# EAGLE design LC_LightCanvas_Rev_2 (EAGLE 7.6.0)
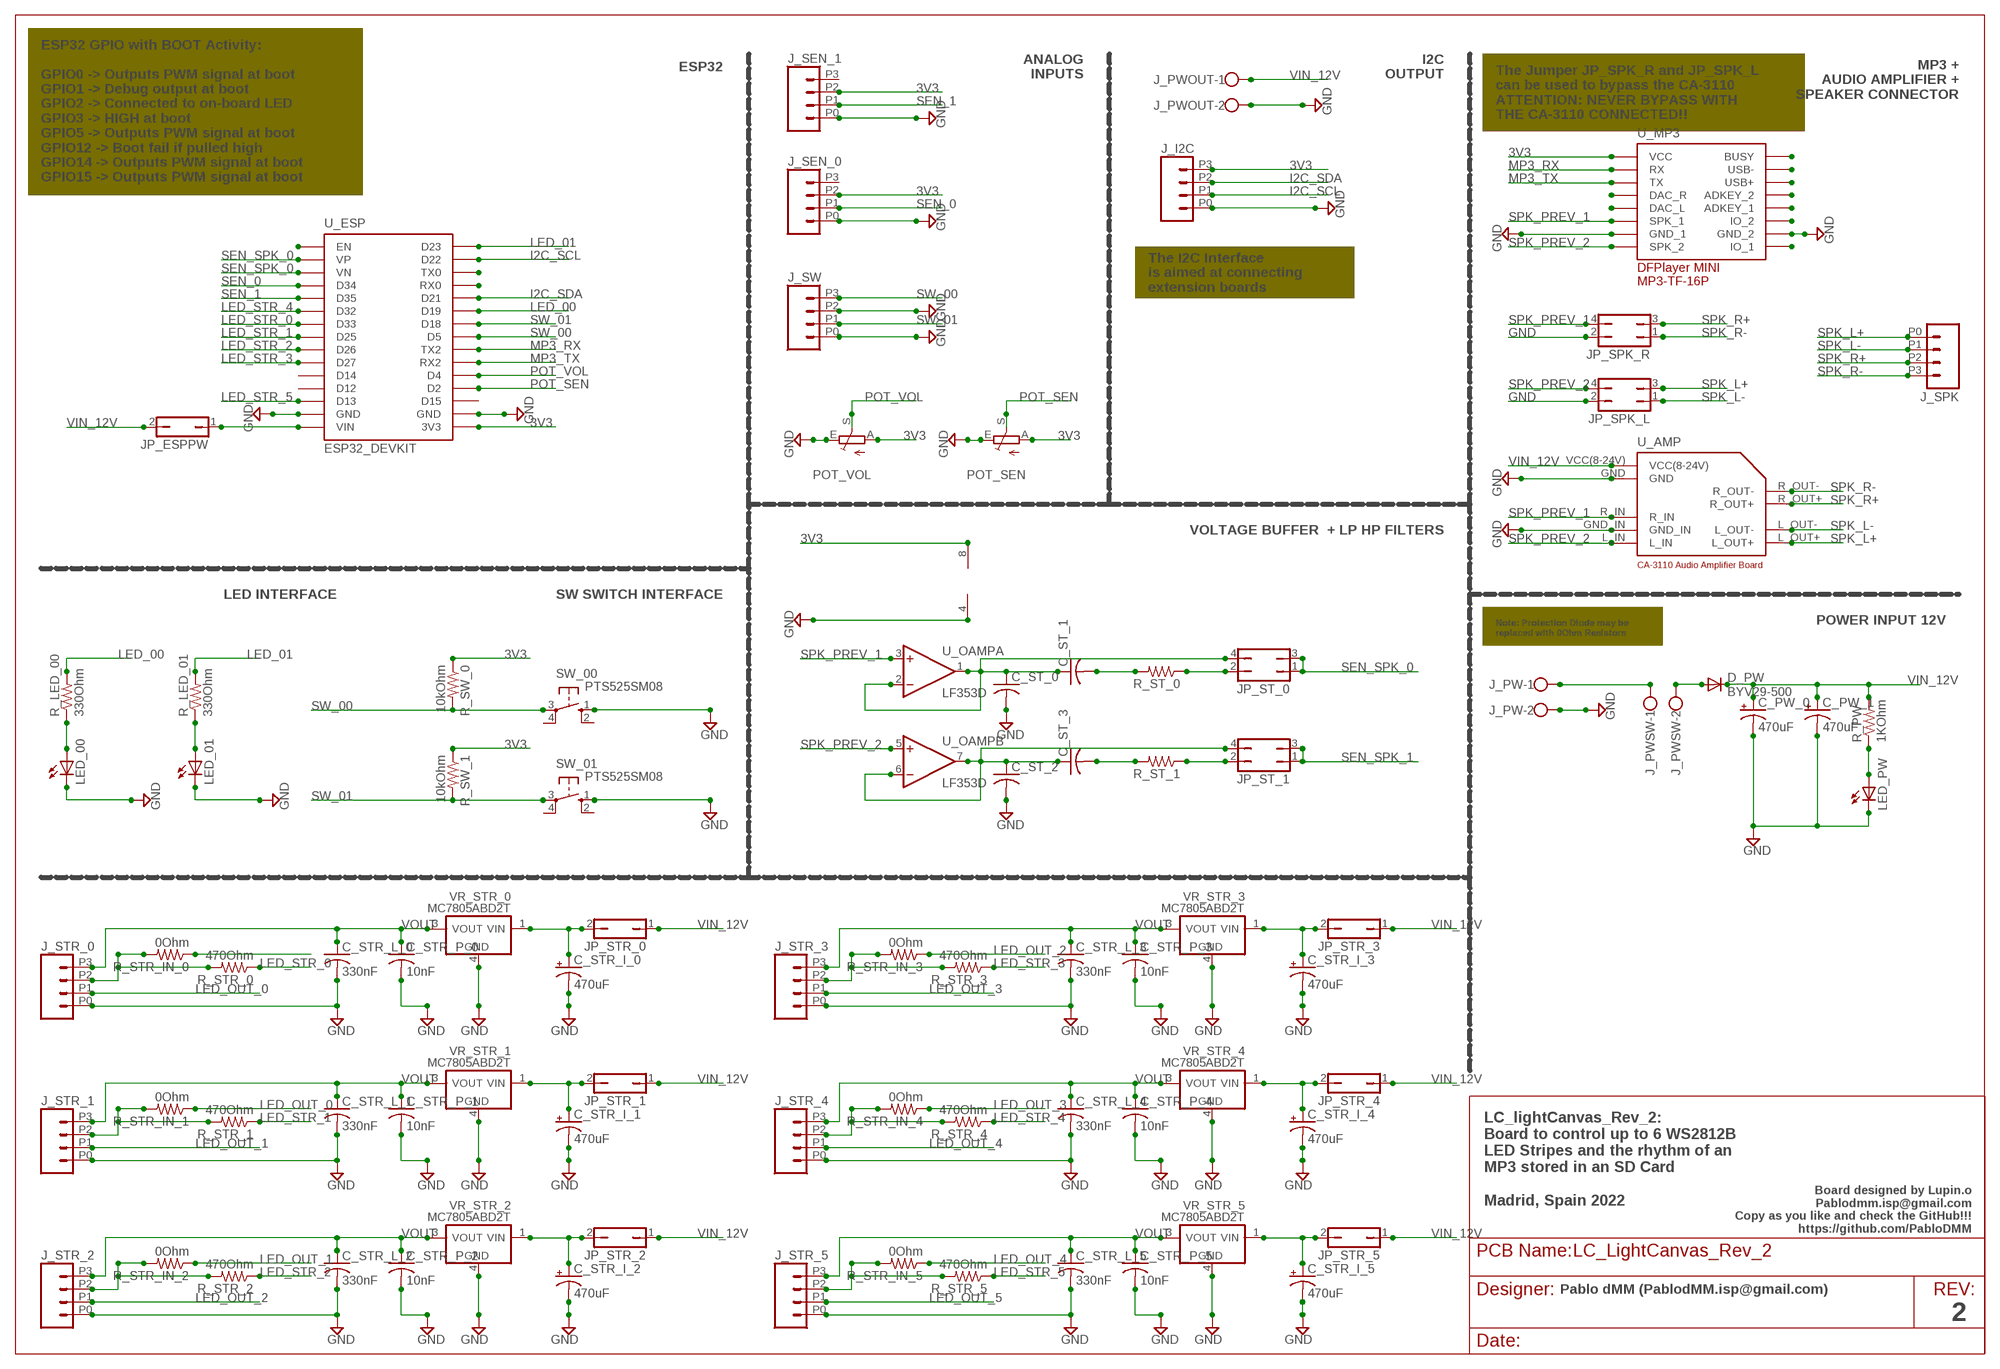
[diagram p0: schematic, sheet 1]

## Parts
C_PW_0  470uF  CPOL-USTT5D10  [TT5D10]
C_PW_1  470uF  CPOL-USTT5D10  [TT5D10]
C_ST_0  C-USC1206  [C1206]
C_ST_1  C-USC1206  [C1206]
C_ST_2  C-USC1206  [C1206]
C_ST_3  C-USC1206  [C1206]
C_STR_I_0  470uF  CPOL-USTT5D10  [TT5D10]
C_STR_I_1  470uF  CPOL-USTT5D10  [TT5D10]
C_STR_I_2  470uF  CPOL-USTT5D10  [TT5D10]
C_STR_I_3  470uF  CPOL-USTT5D10  [TT5D10]
C_STR_I_4  470uF  CPOL-USTT5D10  [TT5D10]
C_STR_I_5  470uF  CPOL-USTT5D10  [TT5D10]
C_STR_L_0  330nF  C-USC1206  [C1206]
C_STR_L_1  330nF  C-USC1206  [C1206]
C_STR_L_2  330nF  C-USC1206  [C1206]
C_STR_L_3  330nF  C-USC1206  [C1206]
C_STR_L_4  330nF  C-USC1206  [C1206]
C_STR_L_5  330nF  C-USC1206  [C1206]
C_STR_P_0  10nF  C-USC1206  [C1206]
C_STR_P_1  10nF  C-USC1206  [C1206]
C_STR_P_2  10nF  C-USC1206  [C1206]
C_STR_P_3  10nF  C-USC1206  [C1206]
C_STR_P_4  10nF  C-USC1206  [C1206]
C_STR_P_5  10nF  C-USC1206  [C1206]
D_PW  BYV29-500  DIODE-TO220H  [TO220AC]
J_I2C  M04  [1X04_2.54_SCREWTERM]
J_PW  W237-102  [W237-102]
J_PWOUT  W237-102  [W237-102]
J_PWSW  W237-102  [W237-102]
J_SEN_0  M04  [1X04_2.54_SCREWTERM]
J_SEN_1  M04  [1X04_2.54_SCREWTERM]
J_SPK  M04  [1X04_2.54_SCREWTERM]
J_STR_0  M04  [1X04_2.54_SCREWTERM]
J_STR_1  M04  [1X04_2.54_SCREWTERM]
J_STR_2  M04  [1X04_2.54_SCREWTERM]
J_STR_3  M04  [1X04_2.54_SCREWTERM]
J_STR_4  M04  [1X04_2.54_SCREWTERM]
J_STR_5  M04  [1X04_2.54_SCREWTERM]
J_SW  M04  [1X04_2.54_SCREWTERM]
JP_ESPPW  JP1Q  [JP1]
JP_SPK_L  JP2Q  [JP2Q]
JP_SPK_R  JP2Q  [JP2Q]
JP_ST_0  JP2Q  [JP2Q]
JP_ST_1  JP2Q  [JP2Q]
JP_STR_0  JP1Q  [JP1]
JP_STR_1  JP1Q  [JP1]
JP_STR_2  JP1Q  [JP1]
JP_STR_3  JP1Q  [JP1]
JP_STR_4  JP1Q  [JP1]
JP_STR_5  JP1Q  [JP1]
LED_00  LEDCHIPLED_1206  [CHIPLED_1206]
LED_01  LEDCHIPLED_1206  [CHIPLED_1206]
LED_PW  LEDCHIPLED_1206  [CHIPLED_1206]
POT_SEN  TRIM_EU-CT6  [CT6]
POT_VOL  TRIM_EU-CT6  [CT6]
R_LED_00  330Ohm  R-US_M1206  [M1206]
R_LED_01  330Ohm  R-US_M1206  [M1206]
R_PW  1KOhm  R-US_M1206  [M1206]
R_ST_0  R-US_M1206  [M1206]
R_ST_1  R-US_M1206  [M1206]
R_STR_0  470Ohm  R-US_M1206  [M1206]
R_STR_1  470Ohm  R-US_M1206  [M1206]
R_STR_2  470Ohm  R-US_M1206  [M1206]
R_STR_3  470Ohm  R-US_M1206  [M1206]
R_STR_4  470Ohm  R-US_M1206  [M1206]
R_STR_5  470Ohm  R-US_M1206  [M1206]
R_STR_IN_0  0Ohm  R-US_M1206  [M1206]
R_STR_IN_1  0Ohm  R-US_M1206  [M1206]
R_STR_IN_2  0Ohm  R-US_M1206  [M1206]
R_STR_IN_3  0Ohm  R-US_M1206  [M1206]
R_STR_IN_4  0Ohm  R-US_M1206  [M1206]
R_STR_IN_5  0Ohm  R-US_M1206  [M1206]
R_SW_0  10kOhm  R-US_M1206  [M1206]
R_SW_1  10kOhm  R-US_M1206  [M1206]
SW_00  PTS525SM08  [SM08]
SW_01  PTS525SM08  [SM08]
U_AMP  CA-3110_AUDIOAMPLIFIER  [CA-3110_AUDIOAMPLIFIER]
U_ESP  ESP32_DEVKIT  [ESP32_DEVKIT]
U_MP3  DFPLAYER  [DFPLAYER]
U_OAMP  LF353D  [SO08]
VR_STR_0  MC7805ABD2T  [D2PAK-3]
VR_STR_1  MC7805ABD2T  [D2PAK-3]
VR_STR_2  MC7805ABD2T  [D2PAK-3]
VR_STR_3  MC7805ABD2T  [D2PAK-3]
VR_STR_4  MC7805ABD2T  [D2PAK-3]
VR_STR_5  MC7805ABD2T  [D2PAK-3]

## Nets
3V3: J_I2C.P3 J_SEN_0.P2 J_SEN_1.P2 POT_SEN.A POT_VOL.A R_SW_0.1 R_SW_1.1 U_ESP.3V3 U_MP3.VCC U_OAMP.8(P:V+)
GND [GND]: C_PW_0.- C_PW_1.- C_ST_0.2 C_ST_2.2 C_STR_I_0.- C_STR_I_1.- C_STR_I_2.- C_STR_I_3.- C_STR_I_4.- C_STR_I_5.- C_STR_L_0.2 C_STR_L_1.2 C_STR_L_2.2 C_STR_L_3.2 C_STR_L_4.2 C_STR_L_5.2 C_STR_P_0.2 C_STR_P_1.2 C_STR_P_2.2 C_STR_P_3.2 C_STR_P_4.2 C_STR_P_5.2 J_I2C.P0 J_PW.2 J_PWOUT.2 J_SEN_0.P0 J_SEN_1.P0 J_STR_0.P0 J_STR_1.P0 J_STR_2.P0 J_STR_3.P0 J_STR_4.P0 J_STR_5.P0 J_SW.P0 J_SW.P2 JP_SPK_L.2 JP_SPK_R.2 LED_00.C LED_01.C LED_PW.C POT_SEN.E POT_VOL.E SW_00.1(S) SW_01.1(S) U_AMP.GND U_AMP.GND_IN U_ESP.GND@1(GND) U_ESP.GND@2(GND) U_MP3.GND_1 U_MP3.GND_2 U_OAMP.4(P:V-) VR_STR_0.4(GND) VR_STR_1.4(GND) VR_STR_2.4(GND) VR_STR_3.4(GND) VR_STR_4.4(GND) VR_STR_5.4(GND)
I2C_SCL: J_I2C.P1 U_ESP.D22
I2C_SDA: J_I2C.P2 U_ESP.D21
LED_00: R_LED_00.2 U_ESP.D19
LED_01: R_LED_01.2 U_ESP.D23
LED_OUT_0: J_STR_0.P1 R_STR_IN_1.1
LED_OUT_1: J_STR_1.P1 R_STR_IN_2.1
LED_OUT_2: J_STR_2.P1 R_STR_IN_3.1
LED_OUT_3: J_STR_3.P1 R_STR_IN_4.1
LED_OUT_4: J_STR_4.P1 R_STR_IN_5.1
LED_OUT_5: J_STR_5.P1
LED_STR_0: R_STR_0.1 U_ESP.D33
LED_STR_1: R_STR_1.1 U_ESP.D25
LED_STR_2: R_STR_2.1 U_ESP.D26
LED_STR_3: R_STR_3.1 U_ESP.D27
LED_STR_4: R_STR_4.1 U_ESP.D32
LED_STR_5: R_STR_5.1 U_ESP.D13
MP3_RX: U_ESP.TX2 U_MP3.RX
MP3_TX: U_ESP.RX2 U_MP3.TX
N$1: LED_01.A R_LED_01.1
N$2: U_MP3.IO2(IO_2)
N$3: J_STR_0.P2 R_STR_0.2 R_STR_IN_0.2
N$4: U_MP3.ADKEY1(ADKEY_1)
N$5: J_STR_1.P2 R_STR_1.2 R_STR_IN_1.2
N$6: R_STR_IN_0.1
N$7: U_MP3.ADKEY2(ADKEY_2)
N$8: LED_00.A R_LED_00.1
N$9 [VCC]: J_PW.1 J_PWSW.1
N$10: LED_PW.A R_PW.1
N$12: JP_ESPPW.1 U_ESP.VIN
N$13: J_STR_2.P2 R_STR_2.2 R_STR_IN_2.2
N$14: U_MP3.USB+
N$15: U_MP3.USB-
N$16: U_MP3.BUSY
N$17: U_ESP.EN
N$18: U_ESP.TX0
N$19: U_ESP.RX0
N$20: J_STR_3.P2 R_STR_3.2 R_STR_IN_3.2
N$21: C_ST_0.1 C_ST_1.1 JP_ST_0.4 U_OAMP.1(A:OUT) U_OAMP.2(A:-IN)
N$22: C_ST_2.1 C_ST_3.1 JP_ST_1.4 U_OAMP.6(B:-IN) U_OAMP.7(B:OUT)
N$23: J_STR_4.P2 R_STR_4.2 R_STR_IN_4.2
N$24 [VCC]: D_PW.A J_PWSW.2
N$25: C_ST_1.2 R_ST_0.2
N$26: J_STR_5.P2 R_STR_5.2 R_STR_IN_5.2
N$27: U_MP3.IO1(IO_1)
N$32: JP_ST_0.2 R_ST_0.1
N$33: U_MP3.DAC_L
N$37: U_MP3.DAC_R
N$73: C_ST_3.2 R_ST_1.2
N$74: JP_ST_1.2 R_ST_1.1
POT_SEN: POT_SEN.S U_ESP.D2
POT_VOL: POT_VOL.S U_ESP.D4
SEN_0: J_SEN_0.P1 U_ESP.D34
SEN_1: J_SEN_1.P1 U_ESP.D35
SEN_SPK_0: JP_ST_0.1 JP_ST_0.3 U_ESP.VN U_ESP.VP
SEN_SPK_1: JP_ST_1.1 JP_ST_1.3
SPK_L+: J_SPK.P0 JP_SPK_L.3 U_AMP.L_OUT+
SPK_L-: J_SPK.P1 JP_SPK_L.1 U_AMP.L_OUT-
SPK_PREV_1: JP_SPK_R.4 U_AMP.R_IN U_MP3.SPK1(SPK_1) U_OAMP.3(A:+IN)
SPK_PREV_2: JP_SPK_L.4 U_AMP.L_IN U_MP3.SPK2(SPK_2) U_OAMP.5(B:+IN)
SPK_R+: J_SPK.P2 JP_SPK_R.3 U_AMP.R_OUT+
SPK_R-: J_SPK.P3 JP_SPK_R.1 U_AMP.R_OUT-
SW_00: J_SW.P3 R_SW_0.2 SW_00.3(P) U_ESP.D5
SW_01: J_SW.P1 R_SW_1.2 SW_01.3(P) U_ESP.D18
VIN_12V [VCC]: C_PW_0.+ C_PW_1.+ D_PW.C J_PWOUT.1 JP_ESPPW.2 JP_STR_0.1 JP_STR_1.1 JP_STR_2.1 JP_STR_3.1 JP_STR_4.1 JP_STR_5.1 R_PW.2 U_AMP.VCC(8-24V)
VIN_POS: C_STR_I_0.+ JP_STR_0.2 VR_STR_0.1(VIN)
VIN_POS1: C_STR_I_1.+ JP_STR_1.2 VR_STR_1.1(VIN)
VIN_POS2: C_STR_I_2.+ JP_STR_2.2 VR_STR_2.1(VIN)
VIN_POS3: C_STR_I_3.+ JP_STR_3.2 VR_STR_3.1(VIN)
VIN_POS4: C_STR_I_4.+ JP_STR_4.2 VR_STR_4.1(VIN)
VIN_POS5: C_STR_I_5.+ JP_STR_5.2 VR_STR_5.1(VIN)
VOUT: C_STR_L_0.1 C_STR_L_1.1 C_STR_L_2.1 C_STR_L_3.1 C_STR_L_4.1 C_STR_L_5.1 C_STR_P_0.1 C_STR_P_1.1 C_STR_P_2.1 C_STR_P_3.1 C_STR_P_4.1 C_STR_P_5.1 J_STR_0.P3 J_STR_1.P3 J_STR_2.P3 J_STR_3.P3 J_STR_4.P3 J_STR_5.P3 VR_STR_0.3(VOUT) VR_STR_1.3(VOUT) VR_STR_2.3(VOUT) VR_STR_3.3(VOUT) VR_STR_4.3(VOUT) VR_STR_5.3(VOUT)
Unconnected: J_SEN_0.P3 J_SEN_1.P3 SW_00.2(S) SW_00.4(P) SW_01.2(S) SW_01.4(P) U_ESP.D12 U_ESP.D14 U_ESP.D15

## Notes on the sheet
- ESP32
- ANALOG
  INPUTS
- I2C
  OUTPUT
- MP3 +
  AUDIO AMPLIFIER +
  SPEAKER CONNECTOR
- The Jumper JP_SPK_R and JP_SPK_L
  can be used to bypass the CA-3110
  ATTENTION: NEVER BYPASS WITH
  THE CA-3110 CONNECTED!!
- ESP32 GPIO with BOOT Activity:
  
  GPIO0 -> Outputs PWM signal at boot
  GPIO1 -> Debug output at boot
  GPIO2 -> Connected to on-board LED
  GPIO3 -> HIGH at boot
  GPIO5 -> Outputs PWM signal at boot
  GPIO12 -> Boot fail if pulled high
  GPIO14 -> Outputs PWM signal at boot
  GPIO15 -> Outputs PWM signal at boot
- The I2C Interface
  is aimed at connecting
  extension boards
- VOLTAGE BUFFER  + LP HP FILTERS
- LED INTERFACE | SW SWITCH INTERFACE
- Note: Protection Diode may be
  replaced with 0Ohm Resistors
- POWER INPUT 12V
- Board designed by Lupin.o
  Pablodmm.isp@gmail.com
  Copy as you like and check the GitHub!!!
  https://github.com/PabloDMM
- LC_lightCanvas_Rev_2:
  Board to control up to 6 WS2812B
  LED Stripes and the rhythm of an 
  MP3 stored in an SD Card
  
  Madrid, Spain 2022
- Pablo dMM (PablodMM.isp@gmail.com)
- 2

## Library data of the parts
C_PW_0 C_PW_1 C_STR_I_0 C_STR_I_1-C_STR_I_5 = adafruit:CPOL-US: POLARIZED CAPACITOR, American symbol
C_ST_0 C_ST_1-C_ST_3 C_STR_L_0 C_STR_L_1-C_STR_L_5 C_STR_P_0 C_STR_P_1-C_STR_P_5 = adafruit:C-US: CAPACITOR, American symbol
D_PW = diode:DIODE-: DIODE
J_I2C J_SEN_0 J_SEN_1 J_SPK J_STR_0 J_STR_1-J_STR_5 J_SW = SparkFun-Connectors2:M04: Header 4 Standard 4-pin 0.1" header. Use with straight break away headers (SKU : PRT-00116), right angle break away headers (PRT-00553), swiss pins (PRT-00743), machine pins (PRT-00117), and female headers (PRT-00115). Molex polarized connector foot print use with SKU : PRT-08231 with associated crimp pins and housings. 1MM SMD Version SKU: PRT-10208
J_PW J_PWOUT J_PWSW = con-wago-500:W237-102: WAGO SCREW CLAMP; MPN: 237-102; OC_FARNELL: unknown; OC_NEWARK: 70K9898
JP_ESPPW JP_STR_0 JP_STR_1-JP_STR_5 = jumper:JP1Q: JUMPER
JP_SPK_L JP_SPK_R JP_ST_0 JP_ST_1 = jumper:JP2Q: JUMPER
LED_00 LED_01 LED_PW = adafruit:LED: LED OSRAM: - CHIPLED LG R971, LG N971, LY N971, LG Q971, LY Q971, LO R971, LY R971 LH N974, LH R974 LS Q976, LO Q976, LY Q976 LO Q996 - Hyper CHIPLED LW Q18S LB Q993, LB Q99A, LB R99A - SideLED LS A670, LO A670, LY A670, LG A670, LP A670 LB A673, LV A673, LT A673, LW A673 LH A674 LY A675 LS A676, LA A676, LO A676, LY A676, LW A676 LS A679, LY A679, LG A679 - Hyper Micro SIDELED® LS Y876, LA Y876, LO Y876, LY Y876 LT Y87S - SmartLED LW L88C, LW L88S LB L89C, LB L89S, LG L890 LS L89K, LO L89K, LY L89K LS L896, LA L896, LO L896, LY L896 - TOPLED LS T670, LO T670, LY T670, LG T670, LP T670 LSG T670, LSP T670, LSY T670, LOP T670, LYG T670 LG T671, LOG T671, LSG T671 LB T673, LV T673, LT T673, LW T673 LH T674 LS T676, LA T676, LO T676, LY T676, LB T676, LH T676, LSB T676, LW T676 LB T67C, LV T67C, LT T67C, LS T67K, LO T67K, LY T67K, LW E67C LS E67B, LA E67B, LO E67B, LY E67B, LB E67C, LV E67C, LT E67C LW T67C LS T679, LY T679, LG T679 LS T770, LO T770, LY T770, LG T770, LP T770 LB T773, LV T773, LT T773, LW T773 LH T774 LS E675, LA E675, LY E675, LS T675 LS T776, LA T776, LO T776, LY T776, LB T776 LHGB T686 LT T68C, LB T68C - Hyper Mini TOPLED® LB M676 - Mini TOPLED Santana® LG M470 LS M47K, LO M47K, LY M47K Source: http://www.osram.convergy.de/
POT_SEN POT_VOL = pot:TRIM_EU-: POTENTIOMETER
R_LED_00 R_LED_01 R_PW R_ST_0 R_ST_1 R_STR_0 R_STR_1-R_STR_5 R_STR_IN_0 R_STR_IN_1-R_STR_IN_5 R_SW_0 R_SW_1 = adafruit:R-US_: RESISTOR, American symbol
SW_00 SW_01 = pts525_20:PTS525*: PTS 525 Series Miniature Tact Switch for SMD Source: http://www.ck-components.com/14407/pts525_8sept14.pdf/; MF: C&K Components; MPN: PTS525SM08SMTR2LFS; OC_FARNELL: unknown; OC_NEWARK: unknown
U_AMP = CA-3110:CA-3110_AUDIOAMPLIFIER: CA-3110 Audio Amplifier Footprint for use in PCB
U_ESP = DOIT_ESP32_DEVKIT:ESP32_DEVKIT: ESP32 DEVKIT BOARD
U_MP3 = DFPlayer_v1:DFPLAYER
U_OAMP = linear:LF353: OP AMP
VR_STR_0 VR_STR_1-VR_STR_5 = _hhn_78xx_79xx_NCV78xx_d2pak_dpak:MC78*: 78xx SMD (D2PAK, DPAK) (MC)78xx..DT (DPAK-3; Rth,JA = 92 K/W) (MC)78xx..D2T (D2PAK-3; Rth,JA = 45 K/W @ 10x10mm copper area) Linear Voltage Regulators, Positive, 1 A (ON Semiconductor) Package dimenisions and soldering footprints acc. to ONSEMI specs. Source: http://onsemi.com Datasheet document#: MC7800/D Technologies: 78xxyD(2)Tz: xx = Output Voltage (V) y, z: additional suffixes see manufacturer's datasheet Author: Dipl.-Ing. FH Rainer Bayer HHN Hochschule Heilbronn, rainer.bayer@hs-heilbronn.de Ingenieurbüro ing-rb, mail@ing-rb.de

## Net classes
0 default: width 0.381 mm
1 GND: width 1.27 mm, clearance 0.305 mm
2 VCC: width 1.27 mm, clearance 0.305 mm to class 1

## Board
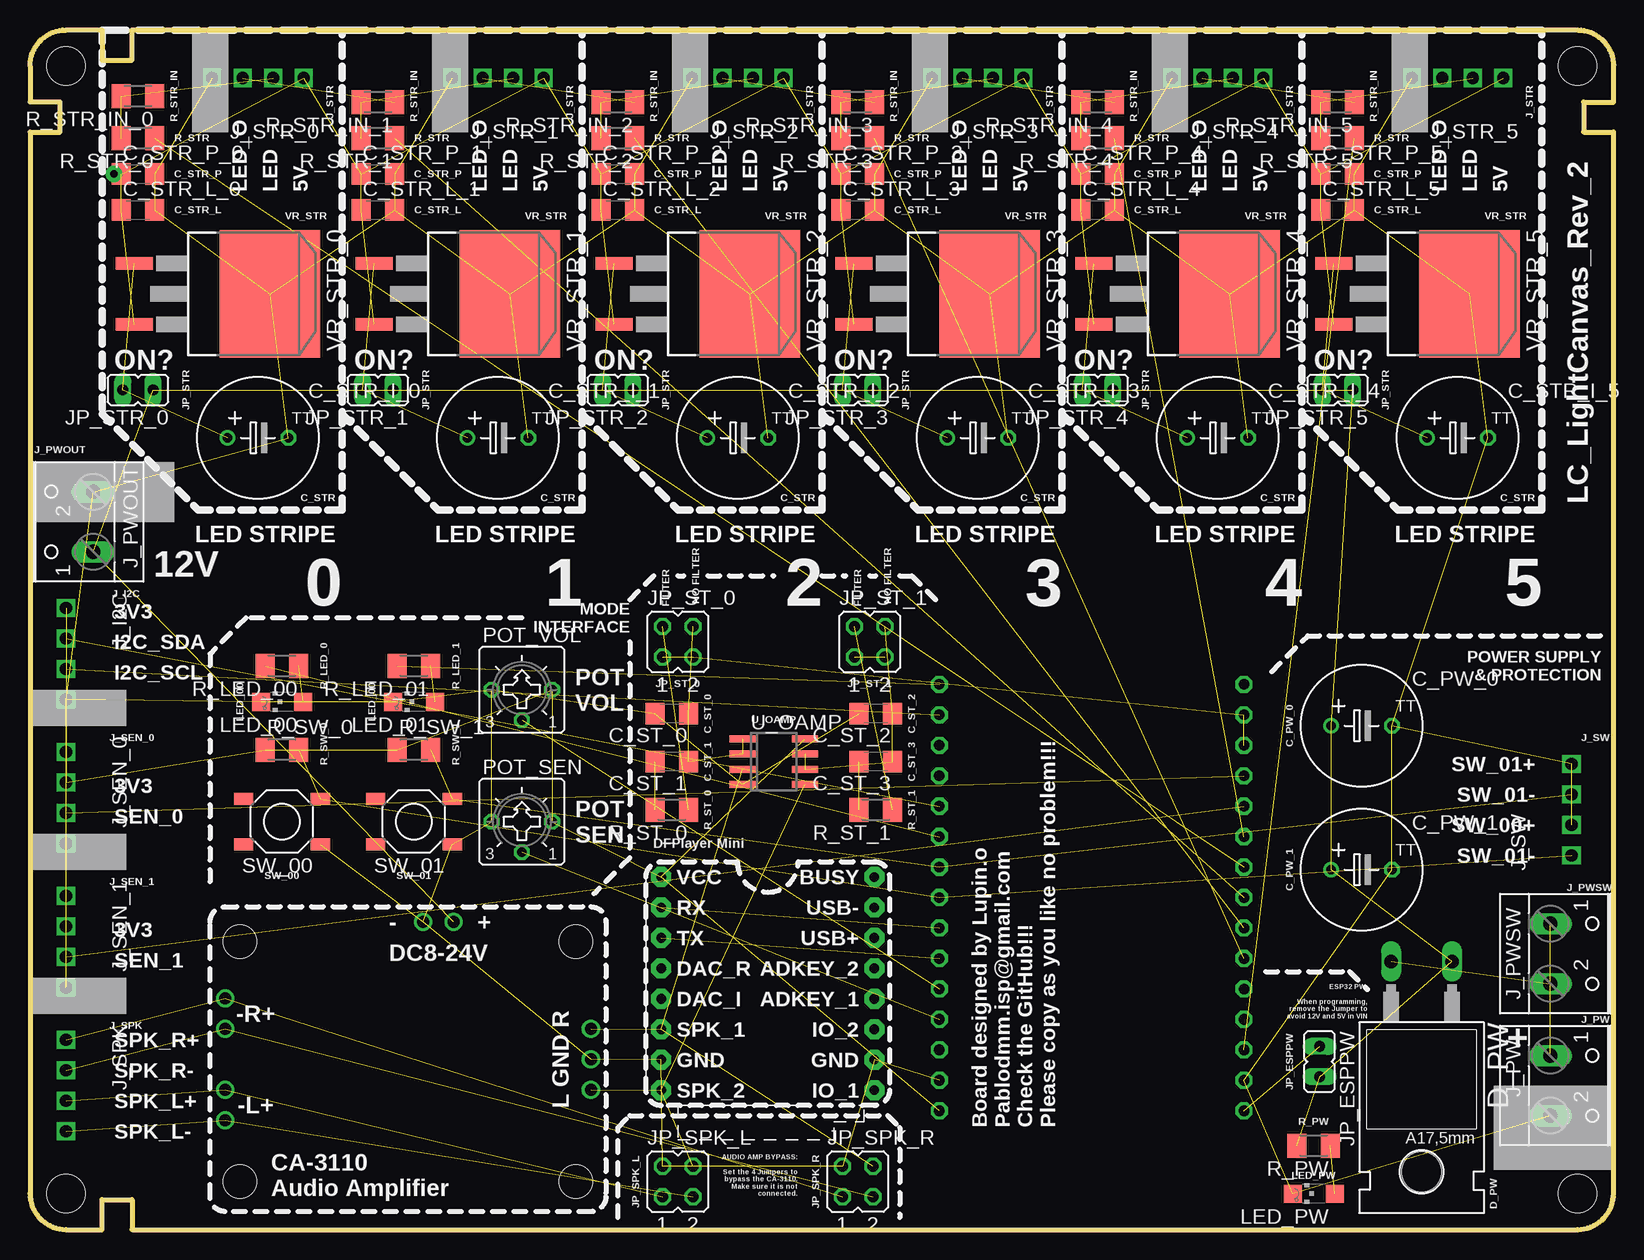
[diagram p1: board, top side]
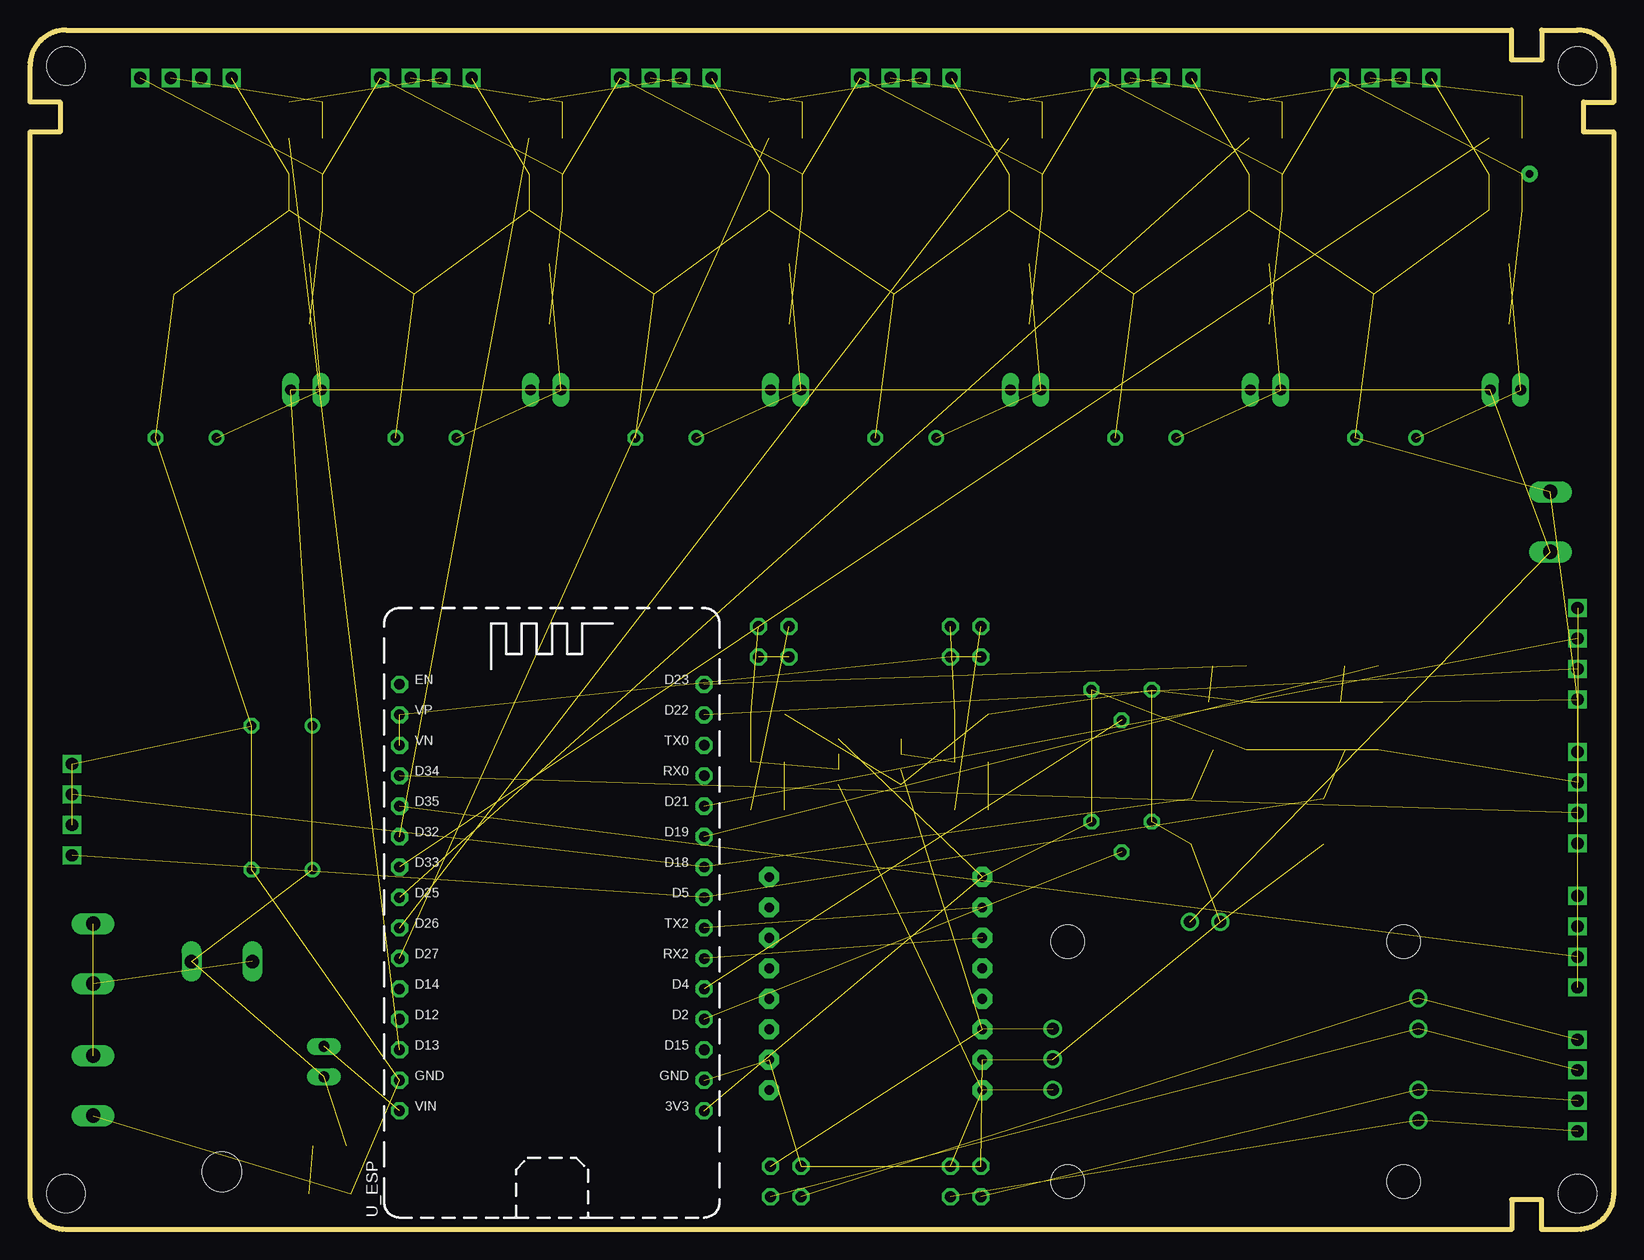
[diagram p2: board, bottom side, seen from below]

Size 132 x 100 mm. Coordinates in mm from the lower left corner, seen from the top.
Outline: 3,0 6,0 6,2.5 8.5,2.5 8.5,0 129,0 arc90 132,3 132,91.5 129.5,91.5 129.5,94 132,94 132,97 arc90 129,100 8.5,100 8.5,97.5 6,97.5 6,100 3,100 arc90 0,97 0,94 2.5,94 2.5,91.5 0,91.5 0,3 arc90 3,0
Copper layers (1*16): Top 0.035mm / dielectric 1.5mm / Bottom 0.035mm
Design rules "default *": minimum track width 20mil, minimum drill 25mil, track to track 10mil, track to pad 10mil, pad to pad 10mil, via to via 10mil, smd to smd 8mil, copper to edge 20mil, drill to drill 8mil, minimum pad ring 10mil, minimum via ring 15mil, stop-mask expansion 4mil, vias tented up to drill 0mil, thermal gap 10mil
Holes 3.2 mm at 129,3 3,3 3,97 129,97

### Footprints (pad centres in the part's own frame; a part is rotated, then mirrored left to right if it is on the bottom)
TT5D10 = drill 0.813: + -2.54,0 | drill 0.813 octagon: - 2.54,0
C1206 = smd 1.6 x 1.8: 1 -1.4,0; 2 1.4,0
TO220AC = drill 1.118 long: A 2.54,-6.35; C -2.54,-6.35 | hole 3.302: 0,11.176
1X04_2.54_SCREWTERM = drill 1.016 square: P0 3.81,0; P1 1.27,0; P2 -1.27,0; P3 -3.81,0
W237-102 = drill 1.194 long: 1 -2.5,-1.27; 2 2.5,-1.27
JP1 = drill 0.914 long: 1 0,-1.27; 2 0,1.27
JP2Q = drill 0.914 octagon: 1 -1.27,-1.27; 2 -1.27,1.27; 3 1.27,-1.27; 4 1.27,1.27
CHIPLED_1206 = smd 1.5 x 1.5: A 0,-1.75; C 0,1.75
CT6 = drill 0.813 octagon: A 2.515,0; E -2.515,0; S 0,-2.54
M1206 = smd 1.6 x 2: 1 -1.4,0; 2 1.4,0
SM08 = smd 1.6 x 1: 1 -3.2,1.9; 2 3.2,1.9; 3 -3.2,-1.9; 4 3.2,-1.9
CA-3110_AUDIOAMPLIFIER = drill 1: GND 17.78,24.13; GND_IN 31.75,12.7; L_IN 31.75,10.16; L_OUT+ 1.27,7.62; L_OUT- 1.27,10.16; R_IN 31.75,15.24; R_OUT+ 1.27,15.24; R_OUT- 1.27,17.78; VCC(8-24V) 20.32,24.13 | hole 2.8: 2.5,2.5; 30.5,2.5; 30.5,22.5; 2.5,22.5
ESP32_DEVKIT = drill 0.9 pad 1.422 octagon: 3V3 12.7,8.89; D2 12.7,16.51; D4 12.7,19.05; D5 12.7,26.67; D12 -12.7,16.51; D13 -12.7,13.97; D14 -12.7,19.05; D15 12.7,13.97; D18 12.7,29.21; D19 12.7,31.75; D21 12.7,34.29; D22 12.7,41.91; D23 12.7,44.45; D25 -12.7,26.67; D26 -12.7,24.13; D27 -12.7,21.59; D32 -12.7,31.75; D33 -12.7,29.21; D34 -12.7,36.83; D35 -12.7,34.29; EN -12.7,44.45; GND@1 -12.7,11.43; GND@2 12.7,11.43; RX0 12.7,36.83; RX2 12.7,21.59; TX0 12.7,39.37; TX2 12.7,24.13; VIN -12.7,8.89; VN -12.7,39.37; VP -12.7,41.91
DFPLAYER = drill 0.8 pad 1.676 octagon: ADKEY1 8.89,-1.27; ADKEY2 8.89,1.27; BUSY 8.89,8.89; DAC_L -8.89,-1.27; DAC_R -8.89,1.27; GND_1 -8.89,-6.35; GND_2 8.89,-6.35; IO1 8.89,-8.89; IO2 8.89,-3.81; RX -8.89,6.35; SPK1 -8.89,-3.81; SPK2 -8.89,-8.89; TX -8.89,3.81; USB+ 8.89,3.81; USB- 8.89,6.35; VCC -8.89,8.89
SO08 = smd 0.6 x 2.2: 1 -1.905,-2.6; 2 -0.635,-2.6; 3 0.635,-2.6; 4 1.905,-2.6; 5 1.905,2.6; 6 0.635,2.6; 7 -0.635,2.6; 8 -1.905,2.6
D2PAK-3 = smd 1.016 x 3.05: 1 -2.54,-11.31; 3 2.54,-11.31 | smd 10.66 x 8.38: 4 0,0

### Placement (x,y rotation side)
C_PW_0  111,42 0 top
C_PW_1  111,30 0 top
C_ST_0  53.5,43 180 top
C_ST_1  53.5,39 180 top
C_ST_2  70.5,43 180 top
C_ST_3  70.5,39 180 top
C_STR_I_0  19,66 0 top
C_STR_I_1  39,66 0 top
C_STR_I_2  59,66 0 top
C_STR_I_3  79,66 0 top
C_STR_I_4  99,66 0 top
C_STR_I_5  119,66 0 top
C_STR_L_0  9,85 0 top
C_STR_L_1  29,85 0 top
C_STR_L_2  49,85 0 top
C_STR_L_3  69,85 0 top
C_STR_L_4  89,85 0 top
C_STR_L_5  109,85 0 top
C_STR_P_0  9,88 0 top
C_STR_P_1  29,88 0 top
C_STR_P_2  49,88 0 top
C_STR_P_3  69,88 0 top
C_STR_P_4  89,88 0 top
C_STR_P_5  109,88 0 top
D_PW  116,16 180 top
J_I2C  3,48 270 top
J_PW  128,12 270 top
J_PWOUT  4,59 90 top
J_PWSW  128,23 270 top
J_SEN_0  3,36 270 top
J_SEN_1  3,24 270 top
J_SPK  3,12 270 top
J_STR_0  19,96 180 top
J_STR_1  39,96 180 top
J_STR_2  59,96 180 top
J_STR_3  79,96 180 top
J_STR_4  99,96 180 top
J_STR_5  119,96 180 top
J_SW  128.5,35 90 top
JP_ESPPW  107.5,14 180 top
JP_SPK_L  54,4 0 top
JP_SPK_R  69,4 0 top
JP_ST_0  54,49 0 top
JP_ST_1  70,49 0 top
JP_STR_0  9,70 90 top
JP_STR_1  29,70 90 top
JP_STR_2  49,70 90 top
JP_STR_3  69,70 90 top
JP_STR_4  89,70 90 top
JP_STR_5  109,70 90 top
LED_00  21,44 90 top
LED_01  32,44 90 top
LED_PW  107,3 90 top
POT_SEN  41,34 0 top
POT_VOL  41,45 0 top
R_LED_00  21,47 180 top
R_LED_01  32,47 180 top
R_PW  107,7 180 top
R_ST_0  53.5,35 180 top
R_ST_1  70.5,35 180 top
R_STR_0  9,91 180 top
R_STR_1  29,91 180 top
R_STR_2  49,91 180 top
R_STR_3  69,91 180 top
R_STR_4  89,91 180 top
R_STR_5  109,91 180 top
R_STR_IN_0  9,94.5 180 top
R_STR_IN_1  29,94 180 top
R_STR_IN_2  49,94 180 top
R_STR_IN_3  69,94 180 top
R_STR_IN_4  89,94 180 top
R_STR_IN_5  109,94 180 top
R_SW_0  21,40 0 top
R_SW_1  32,40 0 top
SW_00  21,34 180 top
SW_01  32,34 180 top
U_AMP  15,1.5 0 top
U_ESP  88.5,1 0 bottom
U_MP3  61.5,20.5 0 top
U_OAMP  62,39 270 top
VR_STR_0  20,78 270 top
VR_STR_1  40,78 270 top
VR_STR_2  60,78 270 top
VR_STR_3  80,78 270 top
VR_STR_4  100,78 270 top
VR_STR_5  120,78 270 top

### Tracks (layer width: path | path; a pad name or v marks a point on that pad's centre or on a via)
3V3  (9 unrouted)
GND  (56 unrouted)
I2C_SCL  (1 unrouted)
I2C_SDA  (1 unrouted)
LED_00  (1 unrouted)
LED_01  (1 unrouted)
LED_OUT_0  (1 unrouted)
LED_OUT_1  (1 unrouted)
LED_OUT_2  (1 unrouted)
LED_OUT_3  (1 unrouted)
LED_OUT_4  (1 unrouted)
LED_STR_0  (1 unrouted)
LED_STR_1  (1 unrouted)
LED_STR_2  (1 unrouted)
LED_STR_3  (1 unrouted)
LED_STR_4  (1 unrouted)
LED_STR_5  (1 unrouted)
MP3_RX  (1 unrouted)
MP3_TX  (1 unrouted)
N$1  (1 unrouted)
N$3  (2 unrouted)
N$5  (2 unrouted)
N$8  (1 unrouted)
N$9  (1 unrouted)
N$10  (1 unrouted)
N$11  (via drill 0.6)
  other vias: 7,88
N$12  (1 unrouted)
N$13  (2 unrouted)
N$20  (2 unrouted)
N$21  (4 unrouted)
N$22  (4 unrouted)
N$23  (2 unrouted)
N$24  (1 unrouted)
N$25  (1 unrouted)
N$26  (2 unrouted)
N$32  (1 unrouted)
N$73  (1 unrouted)
N$74  (1 unrouted)
POT_SEN  (1 unrouted)
POT_VOL  (1 unrouted)
SEN_0  (1 unrouted)
SEN_1  (1 unrouted)
SEN_SPK_0  (3 unrouted)
SEN_SPK_1  (1 unrouted)
SPK_L+  (2 unrouted)
SPK_L-  (2 unrouted)
SPK_PREV_1  (3 unrouted)
SPK_PREV_2  (3 unrouted)
SPK_R+  (2 unrouted)
SPK_R-  (2 unrouted)
SW_00  (3 unrouted)
SW_01  (3 unrouted)
VIN_12V  (12 unrouted)
VIN_POS  (2 unrouted)
VIN_POS1  (2 unrouted)
VIN_POS2  (2 unrouted)
VIN_POS3  (2 unrouted)
VIN_POS4  (2 unrouted)
VIN_POS5  (2 unrouted)
VOUT  (23 unrouted)

### Text on the board
t_Silk: R_STR_IN | J_STR | R_STR_IN | J_STR | R_STR_IN | J_STR | R_STR_IN | J_STR | R_STR_IN | J_STR | R_STR_IN | J_STR | R_STR | R_STR | R_STR | R_STR | R_STR | R_STR | C_STR_P | C_STR_P | C_STR_P | C_STR_P | C_STR_P | C_STR_P | LED_O / LED / 5V | LED_O / LED / 5V | LED_O / LED / 5V | LED_O / LED / 5V | LED_O / LED / 5V | LED_O / LED / 5V | C_STR_L | C_STR_L | C_STR_L | C_STR_L | C_STR_L | C_STR_L | VR_STR | VR_STR | VR_STR | VR_STR | VR_STR | VR_STR | ON? | ON? | ON? | ON? | ON? | ON? | JP_STR | JP_STR | JP_STR | JP_STR | JP_STR | JP_STR | J_PWOUT | C_STR | C_STR | C_STR | C_STR | C_STR | C_STR | LC_LightCanvas_Rev_2 | LED STRIPE | LED STRIPE | LED STRIPE | LED STRIPE | LED STRIPE | LED STRIPE | 12V | 0 | 1 | FILTER | NO FILTER | 2 | FILTER | NO FILTER | 3 | 4 | 5 | J_I2C | MODE / INTERFACE | 3V3 / I2C_SDA / I2C_SCL | R_LED_0 | R_LED_1 | POWER SUPPLY / & PROTECTION | JP_ST_0 | JP_ST_1 | POT / VOL | LED_00 | LED_00 | C_ST_0 | C_ST_2 | U_OAMP | C_PW_0 | J_SEN_0 | J_SW | R_SW_0 | R_SW_1 | C_ST_1 | C_ST_3 | 3V3 / SEN_0 | R_ST_0 | R_ST_1 | SW_01+ / SW_01- / SW_00+ / SW_01- | POT / SEN | SW_00 | SW_01 | C_PW_1 | J_SEN_1 | J_PWSW | 3V3 / SEN_1 | ESP32 PW: / / When programming, / remove the Jumper to / avoid 12V and 5V in VIN | J_PW | J_SPK | + | JP_ESPPW | SPK_R+ / SPK_R- / SPK_L+ / SPK_L- | R_PW | Board designed by Lupin.o / Pablodmm.isp@gmail.com / Check the GitHub!!! / Please copy as you like no problem!!! | JP_SPK_L | AUDIO AMP BYPASS: / / Set the 4 Jumpers to / bypass the CA-3110. / Make sure it is not / connected. | JP_SPK_R | LED_PW | D_PW